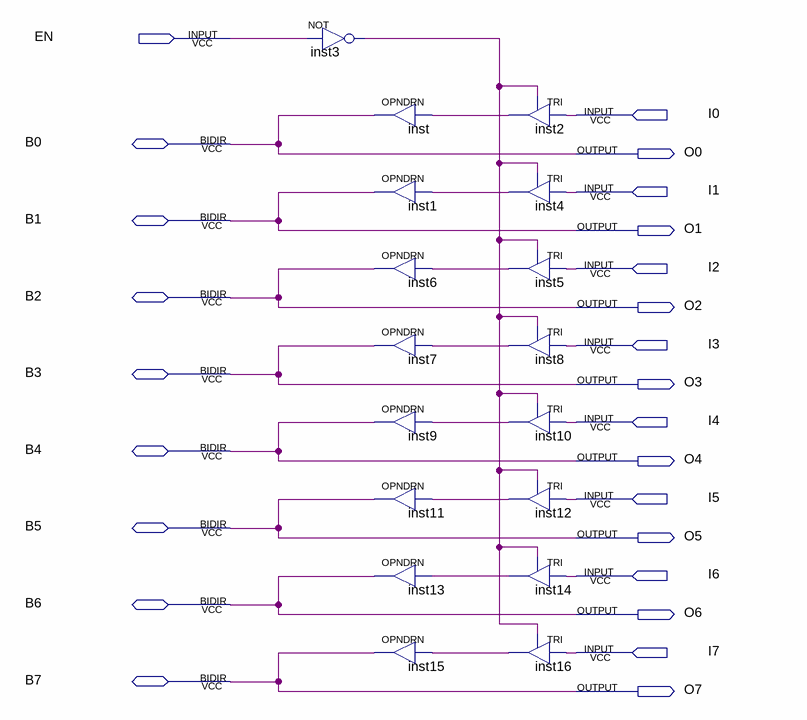
[diagram p0: schematic sheet]
// Quartus schematic 8bidir16xo.bdf as structural Verilog: 17 symbols, 25 pins
module \8bidir16xo  (
  input  EN,
  input  I0,
  input  I1,
  input  I2,
  input  I3,
  input  I4,
  input  I5,
  input  I6,
  input  I7,
  inout  B0,
  inout  B1,
  inout  B2,
  inout  B3,
  inout  B4,
  inout  B5,
  inout  B6,
  inout  B7,
  output O0,
  output O1,
  output O2,
  output O3,
  output O4,
  output O5,
  output O6,
  output O7
);

  wire inst2_out, inst3_out, inst4_out, inst5_out, inst8_out, inst10_out, inst12_out, inst14_out, inst16_out;

  not inst3 (inst3_out, EN);
  OPNDRN inst (.IN(inst2_out), .OUT(B0));
  OPNDRN inst1 (.IN(inst4_out), .OUT(B1));
  OPNDRN inst6 (.IN(inst5_out), .OUT(B2));
  OPNDRN inst7 (.IN(inst8_out), .OUT(B3));
  OPNDRN inst9 (.IN(inst10_out), .OUT(B4));
  OPNDRN inst11 (.IN(inst12_out), .OUT(B5));
  OPNDRN inst13 (.IN(inst14_out), .OUT(B6));
  OPNDRN inst15 (.IN(inst16_out), .OUT(B7));
  TRI inst2 (.IN(I0), .OE(inst3_out), .OUT(inst2_out));
  TRI inst4 (.IN(I1), .OE(inst3_out), .OUT(inst4_out));
  TRI inst5 (.IN(I2), .OE(inst3_out), .OUT(inst5_out));
  TRI inst8 (.IN(I3), .OE(inst3_out), .OUT(inst8_out));
  TRI inst10 (.IN(I4), .OE(inst3_out), .OUT(inst10_out));
  TRI inst12 (.IN(I5), .OE(inst3_out), .OUT(inst12_out));
  TRI inst14 (.IN(I6), .OE(inst3_out), .OUT(inst14_out));
  TRI inst16 (.IN(I7), .OE(inst3_out), .OUT(inst16_out));

  assign O0 = B0;
  assign O1 = B1;
  assign O2 = B2;
  assign O3 = B3;
  assign O4 = B4;
  assign O5 = B5;
  assign O6 = B6;
  assign O7 = B7;
endmodule
